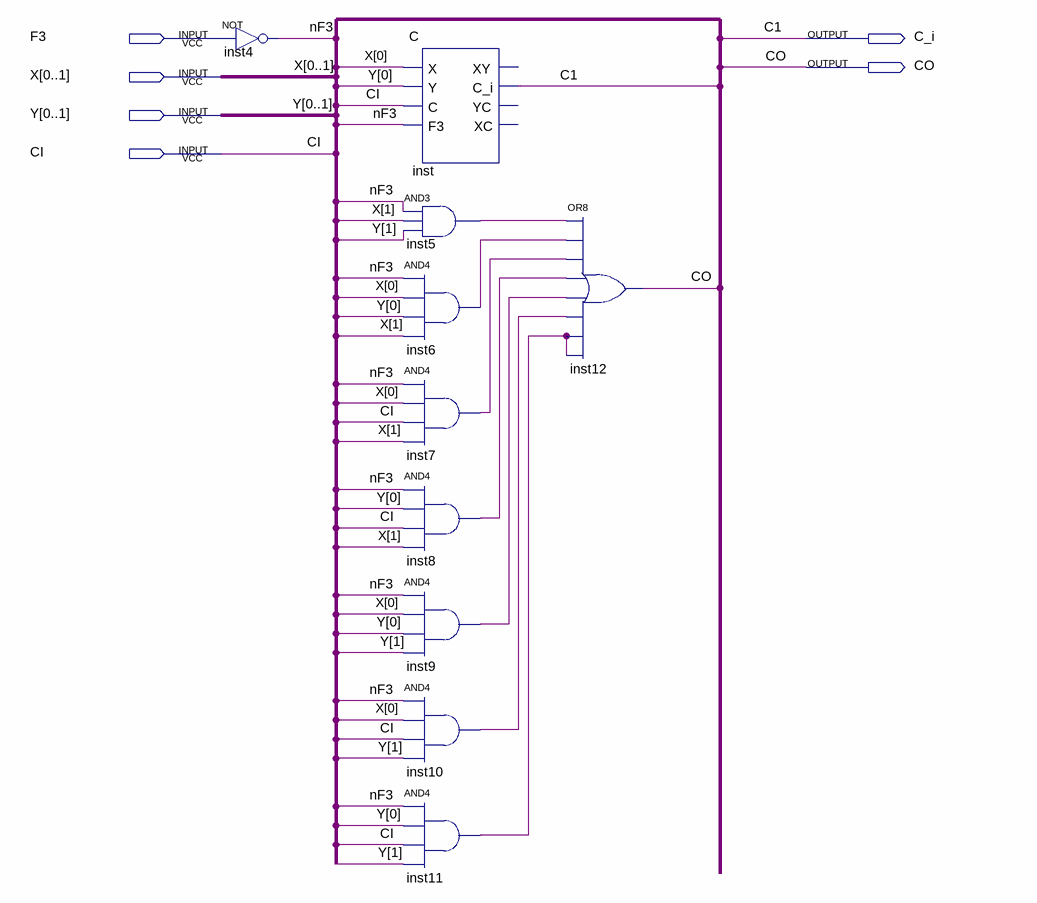
[diagram p0: schematic sheet]
// Quartus schematic cg.bdf as structural Verilog: 10 symbols, 6 pins
module cg (
  input  F3,
  input  [0:1] X,
  input  [0:1] Y,
  input  CI,
  output C_i,
  output CO
);

  wire inst5_out, inst6_out, inst7_out, inst8_out, inst9_out, inst10_out, inst11_out, nF3;

  not inst4 (nF3, F3);
  C inst (.X(X[0]), .Y(Y[0]), .C(CI), .F3(nF3), .C_i(C_i));  // open: XY, YC, XC
  and inst5 (inst5_out, nF3, X[1], Y[1]);
  and inst6 (inst6_out, nF3, X[0], Y[0], X[1]);
  and inst7 (inst7_out, nF3, X[0], CI, X[1]);
  and inst8 (inst8_out, nF3, Y[0], CI, X[1]);
  and inst9 (inst9_out, nF3, X[0], Y[0], Y[1]);
  and inst10 (inst10_out, nF3, X[0], CI, Y[1]);
  and inst11 (inst11_out, nF3, Y[0], CI, Y[1]);
  or inst12 (CO, inst5_out, inst6_out, inst7_out, inst8_out, inst9_out, inst10_out, inst11_out, inst11_out);

  // Other names for the same wires on the sheet: C1 = C_i
endmodule
